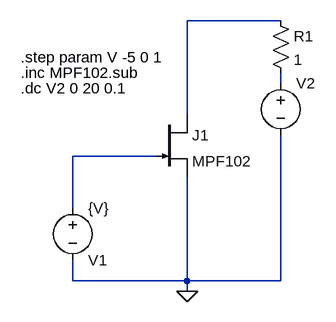
[diagram p0: schematic FET.asc]
FET.asc, the LTspice schematic file:
Version 4
SHEET 1 880 680
WIRE 416 -112 272 -112
WIRE 416 -16 416 -32
WIRE 272 32 272 -112
WIRE 224 96 96 96
WIRE 96 176 96 96
WIRE 96 288 96 256
WIRE 272 288 272 128
WIRE 272 288 96 288
WIRE 416 288 416 64
WIRE 416 288 272 288
WIRE 272 304 272 288
FLAG 272 304 0
SYMBOL voltage 96 160 R0
WINDOW 0 24 96 Left 2
WINDOW 3 24 16 Left 2
WINDOW 123 0 0 Left 0
WINDOW 39 0 0 Left 0
SYMATTR InstName V1
SYMATTR Value {V}
SYMBOL voltage 416 -32 R0
WINDOW 123 0 0 Left 0
WINDOW 39 0 0 Left 0
SYMATTR InstName V2
SYMATTR Value ""
SYMBOL njf 224 32 R0
SYMATTR InstName J1
SYMATTR Value MPF102
SYMBOL res 400 -128 R0
SYMATTR InstName R1
SYMATTR Value 1
TEXT 16 -32 Left 2 !.inc MPF102.sub
TEXT 16 -56 Left 2 !.step param V -5 0 1
TEXT 16 -8 Left 2 !.dc V2 0 20 0.1

The netlist it stands for:
* FET.asc
V1 N003 0 {V}
V2 N002 0
J1 N001 N003 0 MPF102
R1 N001 N002 1
.model NJF NJF
.model PJF PJF
.lib standard.jft
.inc MPF102.sub
.step param V -5 0 1
.dc V2 0 20 0.1
.backanno
.end